# Altium schematic sheet Sheet1.SchDoc
size B; SheetNumber: 1
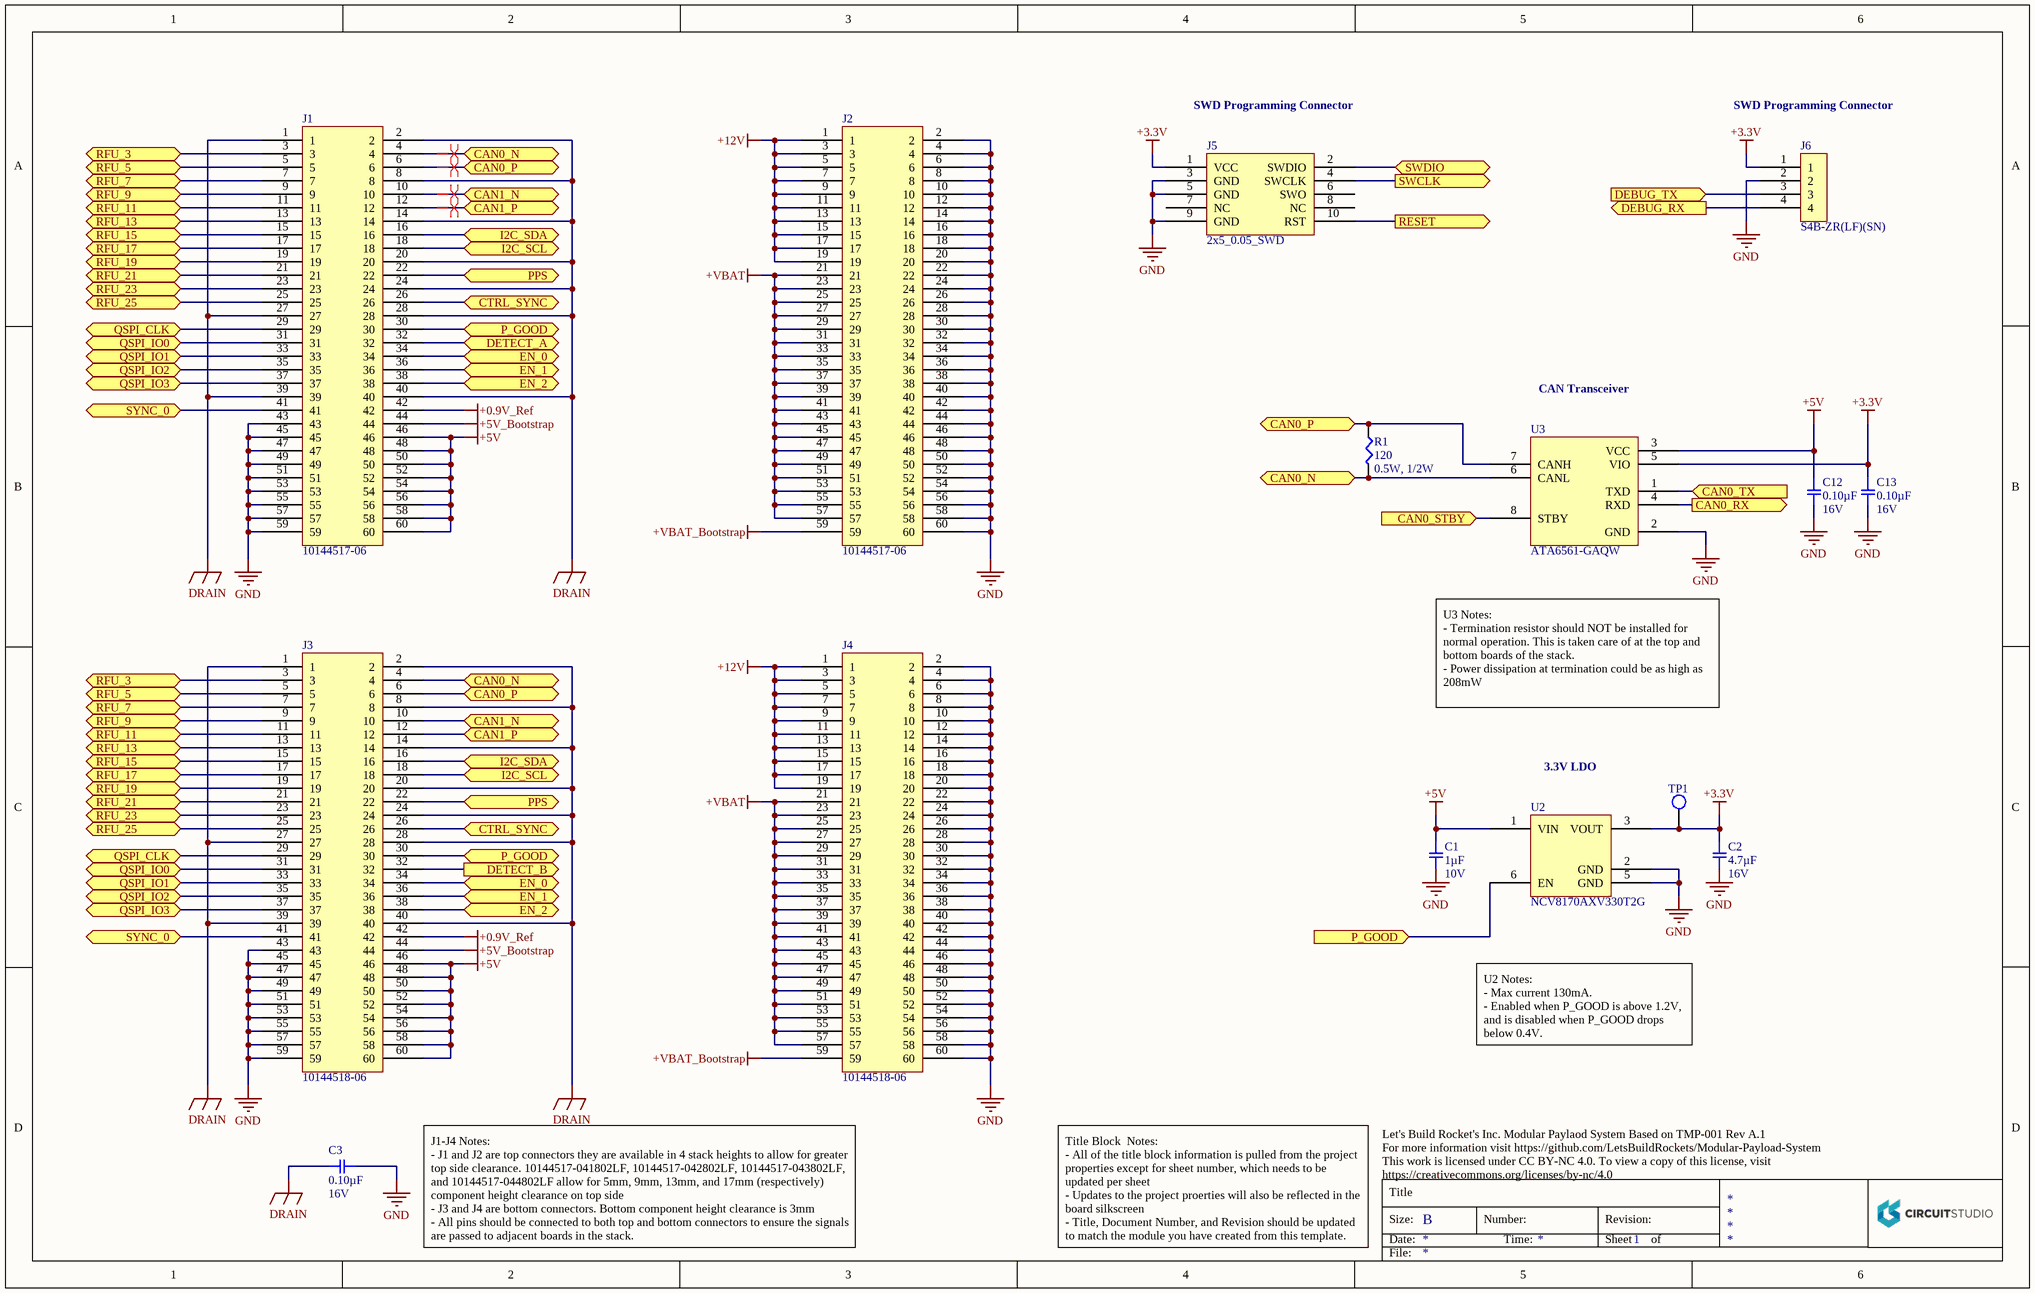
[diagram p0: Sheet1.SchDoc]

## Parts
C1  1µF  Voltage: 10V  [SMD-0402C]
C2  4.7µF  Voltage: 16V  [SMD-0805C]
C3  0.10µF  Voltage: 16V  [SMD-0402C]
C12  0.10µF  Voltage: 16V  [SMD-0402C]
C13  0.10µF  Voltage: 16V  [SMD-0402C]
J1  10144517-06  [10144517-062802LF]
J2  10144517-06  [10144517-062802LF]
J3  10144518-06  [10144518-064802LF]
J4  10144518-06  [10144518-064802LF]
J5  2x5_0.05_SWD  [2x5_0.05_R]
J6  S4B-ZR(LF)(SN)  [S4B-ZR(LF)(SN)]
R1  120  Power (Watts): 0.5W, 1/2W  [SMD-0805-RES]
TP1  TP  [TP_SMD_40]  (value not drawn)  (no BOM)
U2  NCV8170AXV330T2G  [SOTFL50P160X60-6N]
U3  ATA6561-GAQW  [SOIC127P600X175-8N]

## Ports
CAN0_N (bidir), CAN0_P (bidir), CAN0_RX (out), CAN0_STBY (in), CAN0_TX (in), CAN1_N (bidir), CAN1_P (bidir), CTRL_SYNC (bidir), DEBUG_RX (out), DEBUG_TX (in), DETECT_A (bidir), DETECT_B (out), EN_0 (bidir), EN_1 (bidir), EN_2 (bidir), I2C_SCL (bidir), I2C_SDA (bidir), P_GOOD (bidir), P_GOOD (in), PPS (bidir), QSPI_CLK (bidir), QSPI_IO0 (bidir), QSPI_IO1 (bidir), QSPI_IO2 (bidir), QSPI_IO3 (bidir), RESET (out), RFU_3 (bidir), RFU_5 (bidir), RFU_7 (bidir), RFU_9 (bidir), RFU_11 (bidir), RFU_13 (bidir), RFU_15 (bidir), RFU_17 (bidir), RFU_19 (bidir), RFU_21 (bidir), RFU_23 (bidir), RFU_25 (bidir), SWCLK (out), SWDIO (bidir), SYNC_0 (bidir)

## Nets
+0.9V_Ref: J1.42 J3.42
+3.3V: C2.2 C13.1 J5.1(VCC) J6.1 TP1.1 U2.3(VOUT) U3.5(VIO)
+5V: C1.2 C12.1 J1.46 J1.48 J1.50 J1.52 J1.54 J1.56 J1.58 J1.60 J3.46 J3.48 J3.50 J3.52 J3.54 J3.56 J3.58 J3.60 U2.1(VIN) U3.3(VCC)
+5V_Bootstrap: J1.44 J3.44
+12V: J2.1 J2.3 J2.5 J2.7 J2.9 J2.11 J2.13 J2.15 J2.17 J2.19 J4.1 J4.3 J4.5 J4.7 J4.9 J4.11 J4.13 J4.15 J4.17 J4.19
+VBAT: J2.21 J2.23 J2.25 J2.27 J2.29 J2.31 J2.33 J2.35 J2.37 J2.39 J2.41 J2.43 J2.45 J2.47 J2.49 J2.51 J2.53 J2.55 J2.57 J4.21 J4.23 J4.25 J4.27 J4.29 J4.31 J4.33 J4.35 J4.37 J4.39 J4.41 J4.43 J4.45 J4.47 J4.49 J4.51 J4.53 J4.55 J4.57
+VBAT_Bootstrap: J2.59 J4.59
DRAIN: C3.2 J1.1 J1.2 J1.8 J1.14 J1.20 J1.24 J1.27 J1.28 J1.39 J1.40 J3.1 J3.2 J3.8 J3.14 J3.20 J3.24 J3.27 J3.28 J3.39 J3.40
GND: C1.1 C2.1 C3.1 C12.2 C13.2 J1.43 J1.45 J1.47 J1.49 J1.51 J1.53 J1.55 J1.57 J1.59 J2.2 J2.4 J2.6 J2.8 J2.10 J2.12 J2.14 J2.16 J2.18 J2.20 J2.22 J2.24 J2.26 J2.28 J2.30 J2.32 J2.34 J2.36 J2.38 J2.40 J2.42 J2.44 J2.46 J2.48 J2.50 J2.52 J2.54 J2.56 J2.58 J2.60 J3.43 J3.45 J3.47 J3.49 J3.51 J3.53 J3.55 J3.57 J3.59 J4.2 J4.4 J4.6 J4.8 J4.10 J4.12 J4.14 J4.16 J4.18 J4.20 J4.22 J4.24 J4.26 J4.28 J4.30 J4.32 J4.34 J4.36 J4.38 J4.40 J4.42 J4.44 J4.46 J4.48 J4.50 J4.52 J4.54 J4.56 J4.58 J4.60 J5.3(GND) J5.5(GND) J5.9(GND) J6.2 U2.2(GND) U2.5(GND) U3.2(GND)
CAN0_N: J1.4 J3.4 R1.2 U3.6(CANL) ; port CAN0_N
CAN0_P: J1.6 J3.6 R1.1 U3.7(CANH) ; port CAN0_P
CAN0_RX: U3.4(RXD) ; port CAN0_RX
CAN0_STBY: U3.8(STBY) ; port CAN0_STBY
CAN0_TX: U3.1(TXD) ; port CAN0_TX
CAN1_N: J1.10 J3.10 ; port CAN1_N
CAN1_P: J1.12 J3.12 ; port CAN1_P
CTRL_SYNC: J1.26 J3.26 ; port CTRL_SYNC
DEBUG_RX: J6.4 ; port DEBUG_RX
DEBUG_TX: J6.3 ; port DEBUG_TX
DETECT_A: J1.32 ; port DETECT_A
DETECT_B: J3.32 ; port DETECT_B
EN_0: J1.34 J3.34 ; port EN_0
EN_1: J1.36 J3.36 ; port EN_1
EN_2: J1.38 J3.38 ; port EN_2
I2C_SCL: J1.18 J3.18 ; port I2C_SCL
I2C_SDA: J1.16 J3.16 ; port I2C_SDA
P_GOOD: J1.30 J3.30 U2.6(EN) ; port P_GOOD
PPS: J1.22 J3.22 ; port PPS
QSPI_CLK: J1.29 J3.29 ; port QSPI_CLK
QSPI_IO0: J1.31 J3.31 ; port QSPI_IO0
QSPI_IO1: J1.33 J3.33 ; port QSPI_IO1
QSPI_IO2: J1.35 J3.35 ; port QSPI_IO2
QSPI_IO3: J1.37 J3.37 ; port QSPI_IO3
RESET: J5.10(RST) ; port RESET
RFU_3: J1.3 J3.3 ; port RFU_3
RFU_5: J1.5 J3.5 ; port RFU_5
RFU_7: J1.7 J3.7 ; port RFU_7
RFU_9: J1.9 J3.9 ; port RFU_9
RFU_11: J1.11 J3.11 ; port RFU_11
RFU_13: J1.13 J3.13 ; port RFU_13
RFU_15: J1.15 J3.15 ; port RFU_15
RFU_17: J1.17 J3.17 ; port RFU_17
RFU_19: J1.19 J3.19 ; port RFU_19
RFU_21: J1.21 J3.21 ; port RFU_21
RFU_23: J1.23 J3.23 ; port RFU_23
RFU_25: J1.25 J3.25 ; port RFU_25
SWCLK: J5.4(SWCLK) ; port SWCLK
SWDIO: J5.2(SWDIO) ; port SWDIO
SYNC_0: J1.41 J3.41 ; port SYNC_0

Not connected (* = marked no-connect by the designer): J5 6(SWO) 7(NC) 8(NC)

## Layout directives
differential pair: CAN0_N, CAN0_P, CAN1_N, CAN1_P

## Notes on the sheet
- SWD Programming Connector
- CAN Transceiver
- U3 Notes:
  - Termination resistor should NOT be installed for normal operation. This is taken care of at the top and bottom boards of the stack.
  - Power dissipation at termination could be as high as 208mW
- 3.3V LDO
- U2 Notes:
  - Max current 130mA.
  - Enabled when P_GOOD is above 1.2V, and is disabled when P_GOOD drops below 0.4V.
- Let's Build Rocket's Inc. Modular Paylaod System Based on TMP-001 Rev A.1
  For more information visit https://github.com/LetsBuildRockets/Modular-Payload-System
  This work is licensed under CC BY-NC 4.0. To view a copy of this license, visit https://creativecommons.org/licenses/by-nc/4.0
- J1-J4 Notes:
  - J1 and J2 are top connectors they are available in 4 stack heights to allow for greater top side clearance. 10144517-041802LF, 10144517-042802LF, 10144517-043802LF, and 10144517-044802LF allow for 5mm, 9mm, 13mm, and 17mm (respectively) component height clearance on top side
  - J3 and J4 are bottom connectors. Bottom component height clearance is 3mm
  - All pins should be connected to both top and bottom connectors to ensure the signals are passed to adjacent boards in the stack.
- Title Block  Notes:
  - All of the title block information is pulled from the project properties except for sheet number, which needs to be updated per sheet
  - Updates to the project proerties will also be reflected in the board silkscreen
  - Title, Document Number, and Revision should be updated to match the module you have created from this template.
- Title
- Size:
- Date:
- B
- Number:
- Time:
- Revision:
- Sheet
- of
- File:

## Library data of the parts
C1 = GCM155C71A105KE38D: CAP CER 1UF 10V X7S 0402; Manufacturer: Murata Electronics North America; Factory Stock: 0; Unit Price (USD): 0.12; Minimum Quantity: 1; Tolerance: ±10%; Datasheets: http://www.murata.com/~/media/webrenewal/support/library/catalog/products/capacitor/mlcc/c03e.ashx; Image: //media.digikey.com/Renders/Murata%20Renders/ZRB-SERIES-0402.jpg; Digi-Key Part Number: 490-13409-1-ND; Part Number: GCM155C71A105KE38D; Quantity Available: 7240; @ qty: 0; Packaging: Cut Tape (CT); Series: GCM; Part Status: Active; Value: 1µF; Temperature Coefficient: X7S; Operating Temperature: -55°C ~ 125°C; Features: -; Ratings: AEC-Q200; Applications: Automotive; Mounting Type: Surface Mount, MLCC; Package / Case: 0402 (1005 Metric); Size / Dimension: 0.039" L x 0.020" W (1.00mm x 0.50mm); Height - Seated (Max): -; Thickness (Max): 0.022" (0.55mm); Lead Spacing: -; Lead Style: -
C2 = GCJ21BR71C475KA01L: CAP CER 4.7UF 16V X7R 0805; Manufacturer: Murata Electronics North America; Factory Stock: 0; Unit Price (USD): 0.44; Minimum Quantity: 1; Tolerance: ±10%; Datasheets: http://www.murata.com/~/media/webrenewal/support/library/catalog/products/capacitor/mlcc/c03e.ashx; Image: //media.digikey.com/Renders/Murata%20Renders/0805%20(2012%20Metric)%20.85mm.jpg; Digi-Key Part Number: 490-10557-1-ND; Part Number: GCJ21BR71C475KA01L; Quantity Available: 53217; @ qty: 0; Packaging: Cut Tape (CT); Series: GCJ; Part Status: Active; Value: 4.7µF; Temperature Coefficient: X7R; Operating Temperature: -55°C ~ 125°C; Features: Soft Termination; Ratings: AEC-Q200; Applications: Automotive, Boardflex Sensitive; Mounting Type: Surface Mount, MLCC; Package / Case: 0805 (2012 Metric); Size / Dimension: 0.079" L x 0.049" W (2.00mm x 1.25mm); Height - Seated (Max): -; Thickness (Max): 0.057" (1.45mm); Lead Spacing: -; Lead Style: -
C3 C12 C13 = GCM155R71C104KA55D: CAP CER 0.1UF 16V X7R 0402; Manufacturer: Murata Electronics North America; Factory Stock: 0; Unit Price (USD): 0.1; Minimum Quantity: 1; Tolerance: ±10%; Datasheets: http://www.murata.com/~/media/webrenewal/support/library/catalog/products/capacitor/mlcc/c03e.ashx; Image: //media.digikey.com/Renders/Murata%20Renders/ZRB-SERIES-0402.jpg; Digi-Key Part Number: 490-4759-1-ND; Part Number: GCM155R71C104KA55D; Quantity Available: 734194; @ qty: 0; Packaging: Cut Tape (CT); Series: GCM; Part Status: Active; Value: 0.10µF; Temperature Coefficient: X7R; Operating Temperature: -55°C ~ 125°C; Features: -; Ratings: AEC-Q200; Applications: Automotive; Mounting Type: Surface Mount, MLCC; Package / Case: 0402 (1005 Metric); Size / Dimension: 0.039" L x 0.020" W (1.00mm x 0.50mm); Height - Seated (Max): -; Thickness (Max): 0.022" (0.55mm); Lead Spacing: -; Lead Style: -
R1 = ERJ-P6WJ121V: RES SMD 120 OHM 5% 1/2W 0805; Manufacturer: Panasonic Electronic Components; Factory Stock: 0; Unit Price (USD): 0.08237; @ qty: 1500; Minimum Quantity: 1; Temperature Coefficient: ±200ppm/°C; Part Number: ERJ-P6WJ121V; Datasheets: https://industrial.panasonic.com/cdbs/www-data/pdf/RDA0000/AOA0000C243.pdf; Image: //media.digikey.com/Renders/Panasonic%20Renders/ERJ-0805%20Pkg.jpg; Digi-Key Part Number: P16943CT-ND; Quantity Available: 4133; Packaging: Cut Tape (CT); Series: ERJ; Part Status: Active; Value: 120; Tolerance: ±5%; Composition: Thick Film; Features: Automotive AEC-Q200, Pulse Withstanding; Operating Temperature: -55°C ~ 155°C; Package / Case: 0805 (2012 Metric); Supplier Device Package: 0805; Size / Dimension: 0.079" L x 0.049" W (2.00mm x 1.25mm); Height - Seated (Max): 0.030" (0.75mm); Number of Terminations: 2; Failure Rate: -